# Altium schematic sheet Schematic.SchDoc: SMD DC Converter - TPS63001
size A4; Date: 11/05/2021; Author: Carlos Lecaro G.; Engineer: Carlos Lecaro G.; Address1: carlos1992hotmail.es; Address2: Open Source File; Address3: Find on 0xcassds github; Address4: Send a feedback pls; DocumentNumber: 1; Revision: 1.0; SheetNumber: 1; SheetTotal: 1
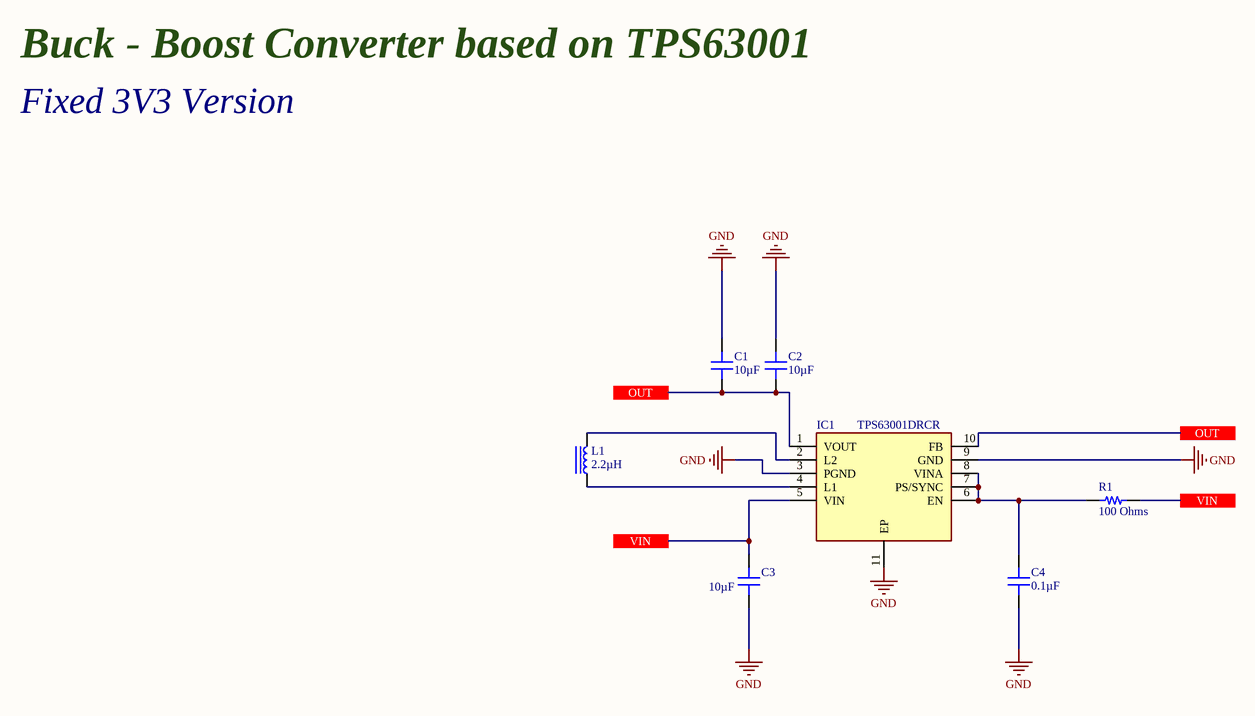
[diagram p0: Schematic.SchDoc]

## Parts
C1  10µF  [CAP 0603_1608]
C2  10µF  [CAP 0603_1608]
C3  10µF  [CAP 0603_1608]
C4  0.1µF  [CAP 0603_1608]
IC1  TPS63001DRCR  [SON50P300X300X100-11N-D]
L1  2.2µH  [TDK SPM3012-LR]
R1  100 Ohms  [RES 0603_1608]

## Ports
OUT, VIN

## Nets
GND: C1.1 C2.1 C3.2 C4.1 IC1.3(PGND) IC1.9(GND) IC1.11(EP)
OUT: C1.2 C2.2 IC1.1(VOUT) IC1.10(FB) ; port OUT
VIN: C3.1 IC1.5(VIN) R1.1 ; port VIN
NetC4_2: C4.2 IC1.6(EN) IC1.7(PS/SYNC) IC1.8(VINA) R1.2
NetIC1_2: IC1.2(L2) L1.2
NetIC1_4: IC1.4(L1) L1.1

## Notes on the sheet
- Buck - Boost Converter based on TPS63001
- Fixed 3V3 Version
- Title
- Size:
- Date:
- A4
- Number:
- Time:
- Revision:
- Sheet
- of
- File:

## Library data of the parts
C1-C3 = CL10B106MQ8NRNC: CAP CER 10UF 6.3V X7R 0603; Manufacturer: Samsung Electro-Mechanics; Tolerance: ±20%; Part Number: CL10B106MQ8NRNC; Value: 10µF; Applications: General Purpose; Capacitance: 10µF; ComponentLink1Description: Datasheet; ComponentLink1URL: http://www.samsungsem.com/kr/support/product-search/mlcc/CL10B106MQ8NRNC.jsp; ComponentLink2Description: DigiKey Link; ComponentLink2URL: http://digikey.com/product-detail/en/samsung-electro-mechanics/CL10B106MQ8NRNC/1276-1948-1-ND/3890034; Device Package: 0603 (1608 Metric); LastUpdated: 2/9/2020 1:03:24; Lifecycle Status: Active; Minimum Order: 1; Mounting Type: Surface Mount, MLCC; Operating Temperature: -55°C ~ 125°C; Package / Case: 0603 (1608 Metric); Packaging: TapeAndReel; PartId: 8640; Part Status: Active; Price: 0.24; Series: CL; Size / Dimension: 0.063" L x 0.031" W (1.60mm x 0.80mm); Supplier 1: DigiKey; Supplier Part Number 1: 1276-1948-1-ND; Temperature Coefficient: X7R; Thickness (Max): 0.035" (0.90mm); Voltage - Rated: 6.3V
C4 = C0603C104K8RACTU: CAP CER 0.1UF 10V X7R 0603; Manufacturer: KEMET; Tolerance: ±10%; Part Number: C0603C104K8RACTU; Value: 0.1µF; Applications: Bypass, Decoupling; Capacitance: 0.1µF; ComponentLink1Description: Datasheet; ComponentLink1URL: https://api.kemet.com/component-edge/download/datasheet/C0603C104K8RACTU.pdf; ComponentLink2Description: DigiKey Link; ComponentLink2URL: http://digikey.com/product-detail/en/kemet/C0603C104K8RACTU/399-1095-1-ND/411370; Device Package: 0603 (1608 Metric); LastUpdated: 2/9/2020 1:03:33; Lifecycle Status: Active; Minimum Order: 1; Mounting Type: Surface Mount, MLCC; Operating Temperature: -55°C ~ 125°C; Package / Case: 0603 (1608 Metric); Packaging: TapeAndReel; PartId: 3742; Part Status: Active; Price: 0.02; Series: SMD Comm X7R; Size / Dimension: 0.063" L x 0.031" W (1.60mm x 0.80mm); Supplier 1: DigiKey; Supplier Part Number 1: 399-1095-1-ND; Temperature Coefficient: X7R; Thickness (Max): 0.034" (0.87mm); Voltage - Rated: 10V
IC1 = TPS63001DRCR: Integrated Circuit; Manufacturer_Name: Texas Instruments; Datasheet Link: https://datasheet.lcsc.com/szlcsc/Texas-Instruments-TI-TPS63001DRCR_C28060.pdf; Height: 1mm; Manufacturer_Part_Number: TPS63001DRCR
L1 = SPM3015T-2R2M-LR: FIXED IND 2.2UH 2.8A 86.6 MOHM; Manufacturer: TDK Corporation; Current - Saturation: 4A; DC Resistance (DCR): 86.6mOhm Max; Inductance Frequency - Test: 100kHz; Material - Core: Metal; Shielding: Shielded; Tolerance: ±20%; Type: Wirewound; Part Number: SPM3015T-2R2M-LR; ComponentLink1Description: Datasheet; ComponentLink1URL: https://product.tdk.com/info/en/catalog/datasheets/inductor_commercial_power_spm3015-lr_en.pdf?ref_disty=digikey; ComponentLink2Description: DigiKey Link; ComponentLink2URL: http://digikey.com/product-detail/en/tdk-corporation/SPM3015T-2R2M-LR/445-174449-1-ND/5962375; Current Rating (Amps): 2.8A; Device Package: Nonstandard; Height - Seated (Max): 0.047" (1.20mm); Inductance: 2.2µH; LastUpdated: 2/9/2020 1:22:14; Lifecycle Status: Active; Minimum Order: 1; Mounting Type: Surface Mount; Operating Temperature: -40°C ~ 125°C; Package / Case: Nonstandard; Packaging: TapeAndReel; PartId: 150; Part Status: Active; Price: 0.59; Series: SPM-LR; Size / Dimension: 0.126" L x 0.118" W (3.20mm x 3.00mm); Supplier 1: DigiKey; Supplier Part Number 1: 445-174449-1-ND; Value: 2.2µH
R1 = RNCS0603BKE100R: RES 100 OHM 0.1% 1/16W 0603; Manufacturer: Stackpole Electronics Inc; Power (Watts): 0.063W, 1/16W; Temperature Coefficient: ±25ppm/°C; Part Number: RNCS0603BKE100R; Value: 100 Ohms; ComponentLink1Description: Datasheet; ComponentLink1URL: https://www.seielect.com/catalog/sei-rncs_rnch.pdf; ComponentLink2Description: DigiKey Link; ComponentLink2URL: http://digikey.com/product-detail/en/stackpole-electronics-inc/RNCS0603BKE100R/RNCS0603BKE100RCT-ND/1800117; Composition: Thin Film; Device Package: 0603 (1608 Metric); Features: Anti-Corrosive, Automotive AEC-Q200, Moisture Resistant; Height - Seated (Max): 0.022" (0.55mm); LastUpdated: 2/9/2020 1:10:25; Lifecycle Status: Active; Minimum Order: 1; Number of Terminations: 2; Operating Temperature: -55°C ~ 155°C; Package / Case: 0603 (1608 Metric); Packaging: TapeAndReel; PartId: 4839; Part Status: Active; Price: 0.08; Ratings: AEC-Q200; Resistance: 100 Ohms; Series: RNCS; Size / Dimension: 0.061" L x 0.031" W (1.55mm x 0.80mm); Supplier 1: DigiKey; Supplier Part Number 1: RNCS0603BKE100RCT-ND; Supplier Device Package: 0603; Tolerance: ±0.1%